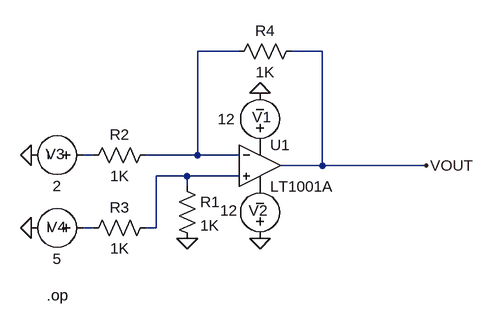
[diagram p0: schematic Differential Amplifier.asc]
Differential Amplifier.asc, the LTspice schematic file:
Version 4
SHEET 1 880 680
WIRE 192 0 128 0
WIRE 320 0 272 0
WIRE -32 160 -48 160
WIRE 128 160 128 0
WIRE 128 160 48 160
WIRE 192 160 128 160
WIRE 320 176 320 0
WIRE 320 176 256 176
WIRE 480 176 320 176
WIRE 112 192 64 192
WIRE 192 192 112 192
WIRE 112 208 112 192
WIRE -32 272 -48 272
WIRE 64 272 64 192
WIRE 64 272 48 272
FLAG 224 64 0
FLAG 224 288 0
FLAG -128 160 0
FLAG -128 272 0
FLAG 480 176 VOUT
FLAG 112 288 0
SYMBOL OpAmps\\LT1001A 224 112 R0
SYMATTR InstName U1
SYMBOL voltage 224 160 R180
WINDOW 0 -17 59 Left 2
WINDOW 3 38 56 Left 2
WINDOW 123 0 0 Left 0
WINDOW 39 0 0 Left 0
SYMATTR InstName V1
SYMATTR Value 12
SYMBOL voltage 224 304 R180
WINDOW 0 -12 59 Left 2
WINDOW 3 34 59 Left 2
WINDOW 123 0 0 Left 0
WINDOW 39 0 0 Left 0
SYMATTR InstName V2
SYMATTR Value 12
SYMBOL voltage -32 160 R90
WINDOW 0 14 59 VBottom 2
WINDOW 3 32 56 VTop 2
WINDOW 123 0 0 Left 0
WINDOW 39 0 0 Left 0
SYMATTR InstName V3
SYMATTR Value 2
SYMBOL voltage -32 272 R90
WINDOW 0 14 57 VBottom 2
WINDOW 3 32 56 VTop 2
WINDOW 123 0 0 Left 0
WINDOW 39 0 0 Left 0
SYMATTR InstName V4
SYMATTR Value 5
SYMBOL res 96 192 R0
SYMATTR InstName R1
SYMATTR Value 1K
SYMBOL res 64 144 R90
WINDOW 0 0 56 VBottom 2
WINDOW 3 32 56 VTop 2
SYMATTR InstName R2
SYMATTR Value 1K
SYMBOL res 64 256 R90
WINDOW 0 0 56 VBottom 2
WINDOW 3 32 56 VTop 2
SYMATTR InstName R3
SYMATTR Value 1K
SYMBOL res 288 -16 R90
WINDOW 0 0 56 VBottom 2
WINDOW 3 32 56 VTop 2
SYMATTR InstName R4
SYMATTR Value 1K
TEXT -104 376 Left 2 !.op

The netlist it stands for:
* Differential Amplifier.asc
XU1 N003 N001 P001 P002 VOUT LT1001  ; LT1001A, pins In+ In- V+ V- OUT
V1 P001 0 12
V2 0 P002 12
V3 N002 0 2
V4 N004 0 5
R1 N003 0 1K
R2 N001 N002 1K
R3 N003 N004 1K
R4 VOUT N001 1K
.op
.lib LTC.lib
.backanno
.end